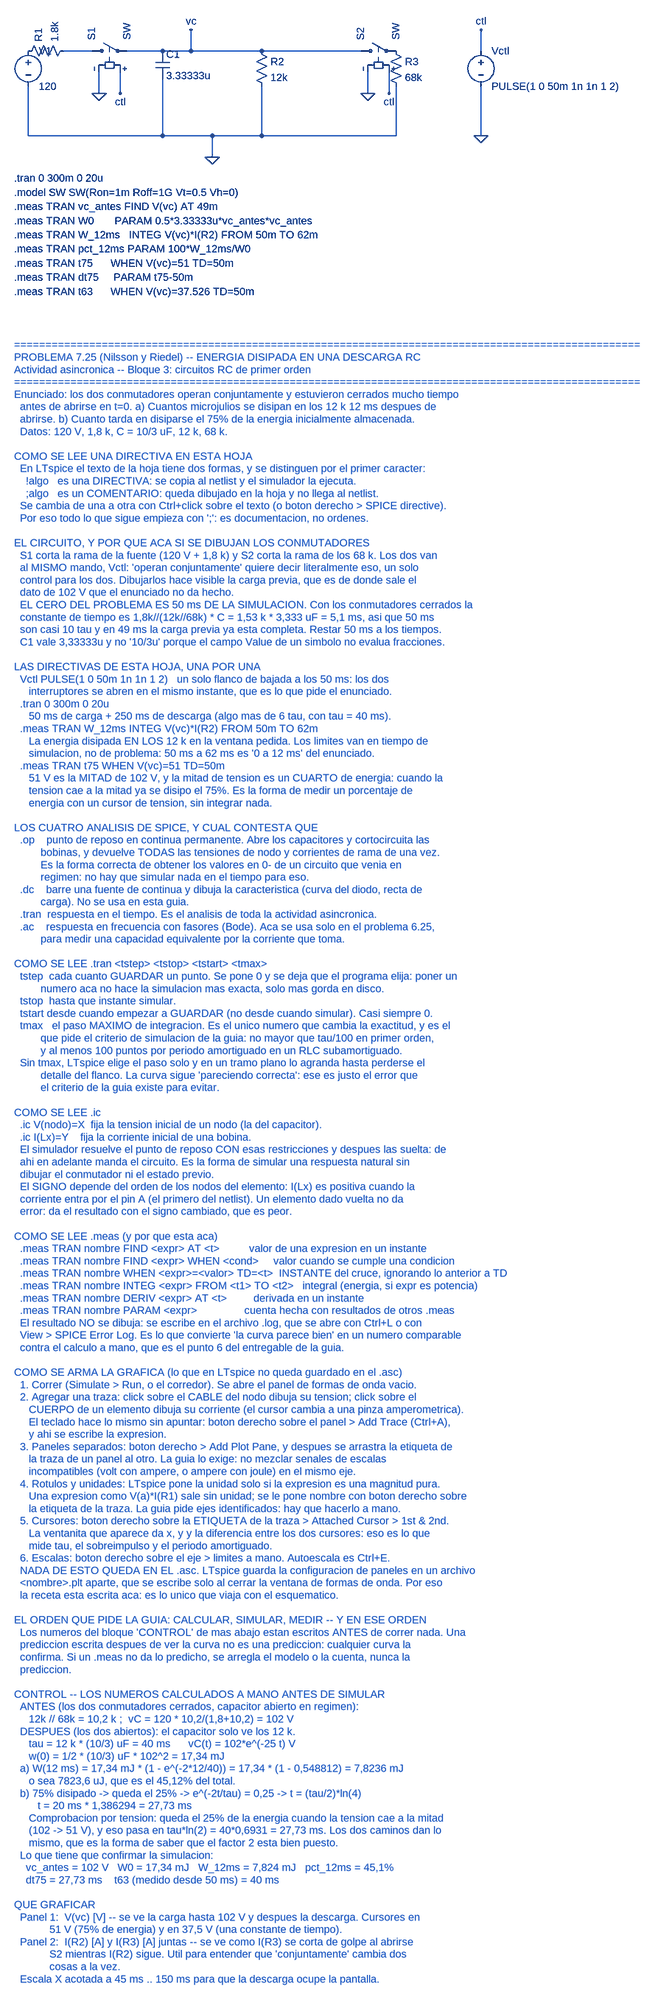
[diagram p0: schematic P7-25_RC_energia_disipada.asc]
P7-25_RC_energia_disipada.asc, the LTspice schematic file:
Version 4
SHEET 1 2200 2800
WIRE 96 192 96 304
WIRE 176 112 240 112
WIRE 320 112 400 112
WIRE 400 176 400 304
WIRE 624 192 624 304
WIRE 400 112 624 112
WIRE 624 112 848 112
WIRE 928 192 928 304
WIRE 96 304 928 304
WIRE 512 304 512 352
WIRE 464 112 464 64
WIRE 256 160 256 208
WIRE 304 160 304 208
WIRE 864 160 864 208
WIRE 912 160 912 208
WIRE 1120 112 1120 64
WIRE 1120 192 1120 304
FLAG 512 352 0
FLAG 464 64 vc
FLAG 256 208 0
FLAG 304 208 ctl
FLAG 864 208 0
FLAG 912 208 ctl
FLAG 1120 64 ctl
FLAG 1120 304 0
SYMBOL voltage 96 96 R0
WINDOW 123 0 0 Left 0
WINDOW 39 0 0 Left 0
SYMATTR InstName V1
SYMATTR Value 120
SYMBOL res 80 128 R270
SYMATTR InstName R1
SYMATTR Value 1.8k
SYMBOL sw 224 112 R270
SYMATTR InstName S1
SYMATTR Value SW
SYMBOL cap 384 112 R0
SYMATTR InstName C1
SYMATTR Value 3.33333u
SYMBOL res 608 96 R0
SYMATTR InstName R2
SYMATTR Value 12k
SYMBOL sw 832 112 R270
SYMATTR InstName S2
SYMATTR Value SW
SYMBOL res 912 96 R0
SYMATTR InstName R3
SYMATTR Value 68k
SYMBOL voltage 1120 96 R0
WINDOW 123 0 0 Left 0
WINDOW 39 0 0 Left 0
SYMATTR InstName Vctl
SYMATTR Value PULSE(1 0 50m 1n 1n 1 2)
TEXT 64 400 Left 2 !.tran 0 300m 0 20u
TEXT 64 432 Left 2 !.model SW SW(Ron=1m Roff=1G Vt=0.5 Vh=0)
TEXT 64 464 Left 2 !.meas TRAN vc_antes FIND V(vc) AT 49m
TEXT 64 496 Left 2 !.meas TRAN W0       PARAM 0.5*3.33333u*vc_antes*vc_antes
TEXT 64 528 Left 2 !.meas TRAN W_12ms   INTEG V(vc)*I(R2) FROM 50m TO 62m
TEXT 64 560 Left 2 !.meas TRAN pct_12ms PARAM 100*W_12ms/W0
TEXT 64 592 Left 2 !.meas TRAN t75      WHEN V(vc)=51 TD=50m
TEXT 64 624 Left 2 !.meas TRAN dt75     PARAM t75-50m
TEXT 64 656 Left 2 !.meas TRAN t63      WHEN V(vc)=37.526 TD=50m
TEXT 64 900 Left 2 ;====================================================================================================
TEXT 64 928 Left 2 ;PROBLEMA 7.25 (Nilsson y Riedel) -- ENERGIA DISIPADA EN UNA DESCARGA RC
TEXT 64 956 Left 2 ;Actividad asincronica -- Bloque 3: circuitos RC de primer orden
TEXT 64 984 Left 2 ;====================================================================================================
TEXT 64 1012 Left 2 ;Enunciado: los dos conmutadores operan conjuntamente y estuvieron cerrados mucho tiempo
TEXT 64 1040 Left 2 ;  antes de abrirse en t=0. a) Cuantos microjulios se disipan en los 12 k 12 ms despues de
TEXT 64 1068 Left 2 ;  abrirse. b) Cuanto tarda en disiparse el 75% de la energia inicialmente almacenada.
TEXT 64 1096 Left 2 ;  Datos: 120 V, 1,8 k, C = 10/3 uF, 12 k, 68 k.
TEXT 64 1124 Left 2 ;
TEXT 64 1152 Left 2 ;COMO SE LEE UNA DIRECTIVA EN ESTA HOJA
TEXT 64 1180 Left 2 ;  En LTspice el texto de la hoja tiene dos formas, y se distinguen por el primer caracter:
TEXT 64 1208 Left 2 ;    !algo   es una DIRECTIVA: se copia al netlist y el simulador la ejecuta.
TEXT 64 1236 Left 2 ;    ;algo   es un COMENTARIO: queda dibujado en la hoja y no llega al netlist.
TEXT 64 1264 Left 2 ;  Se cambia de una a otra con Ctrl+click sobre el texto (o boton derecho > SPICE directive).
TEXT 64 1292 Left 2 ;  Por eso todo lo que sigue empieza con ';': es documentacion, no ordenes.
TEXT 64 1320 Left 2 ;
TEXT 64 1348 Left 2 ;EL CIRCUITO, Y POR QUE ACA SI SE DIBUJAN LOS CONMUTADORES
TEXT 64 1376 Left 2 ;  S1 corta la rama de la fuente (120 V + 1,8 k) y S2 corta la rama de los 68 k. Los dos van
TEXT 64 1404 Left 2 ;  al MISMO mando, Vctl: 'operan conjuntamente' quiere decir literalmente eso, un solo
TEXT 64 1432 Left 2 ;  control para los dos. Dibujarlos hace visible la carga previa, que es de donde sale el
TEXT 64 1460 Left 2 ;  dato de 102 V que el enunciado no da hecho.
TEXT 64 1488 Left 2 ;  EL CERO DEL PROBLEMA ES 50 ms DE LA SIMULACION. Con los conmutadores cerrados la
TEXT 64 1516 Left 2 ;  constante de tiempo es 1,8k//(12k//68k) * C = 1,53 k * 3,333 uF = 5,1 ms, asi que 50 ms
TEXT 64 1544 Left 2 ;  son casi 10 tau y en 49 ms la carga previa ya esta completa. Restar 50 ms a los tiempos.
TEXT 64 1572 Left 2 ;  C1 vale 3,33333u y no '10/3u' porque el campo Value de un simbolo no evalua fracciones.
TEXT 64 1600 Left 2 ;
TEXT 64 1628 Left 2 ;LAS DIRECTIVAS DE ESTA HOJA, UNA POR UNA
TEXT 64 1656 Left 2 ;  Vctl PULSE(1 0 50m 1n 1n 1 2)   un solo flanco de bajada a los 50 ms: los dos
TEXT 64 1684 Left 2 ;     interruptores se abren en el mismo instante, que es lo que pide el enunciado.
TEXT 64 1712 Left 2 ;  .tran 0 300m 0 20u
TEXT 64 1740 Left 2 ;     50 ms de carga + 250 ms de descarga (algo mas de 6 tau, con tau = 40 ms).
TEXT 64 1768 Left 2 ;  .meas TRAN W_12ms INTEG V(vc)*I(R2) FROM 50m TO 62m
TEXT 64 1796 Left 2 ;     La energia disipada EN LOS 12 k en la ventana pedida. Los limites van en tiempo de
TEXT 64 1824 Left 2 ;     simulacion, no de problema: 50 ms a 62 ms es '0 a 12 ms' del enunciado.
TEXT 64 1852 Left 2 ;  .meas TRAN t75 WHEN V(vc)=51 TD=50m
TEXT 64 1880 Left 2 ;     51 V es la MITAD de 102 V, y la mitad de tension es un CUARTO de energia: cuando la
TEXT 64 1908 Left 2 ;     tension cae a la mitad ya se disipo el 75%. Es la forma de medir un porcentaje de
TEXT 64 1936 Left 2 ;     energia con un cursor de tension, sin integrar nada.
TEXT 64 1964 Left 2 ;
TEXT 64 1992 Left 2 ;LOS CUATRO ANALISIS DE SPICE, Y CUAL CONTESTA QUE
TEXT 64 2020 Left 2 ;  .op    punto de reposo en continua permanente. Abre los capacitores y cortocircuita las
TEXT 64 2048 Left 2 ;         bobinas, y devuelve TODAS las tensiones de nodo y corrientes de rama de una vez.
TEXT 64 2076 Left 2 ;         Es la forma correcta de obtener los valores en 0- de un circuito que venia en
TEXT 64 2104 Left 2 ;         regimen: no hay que simular nada en el tiempo para eso.
TEXT 64 2132 Left 2 ;  .dc    barre una fuente de continua y dibuja la caracteristica (curva del diodo, recta de
TEXT 64 2160 Left 2 ;         carga). No se usa en esta guia.
TEXT 64 2188 Left 2 ;  .tran  respuesta en el tiempo. Es el analisis de toda la actividad asincronica.
TEXT 64 2216 Left 2 ;  .ac    respuesta en frecuencia con fasores (Bode). Aca se usa solo en el problema 6.25,
TEXT 64 2244 Left 2 ;         para medir una capacidad equivalente por la corriente que toma.
TEXT 64 2272 Left 2 ;
TEXT 64 2300 Left 2 ;COMO SE LEE .tran <tstep> <tstop> <tstart> <tmax>
TEXT 64 2328 Left 2 ;  tstep  cada cuanto GUARDAR un punto. Se pone 0 y se deja que el programa elija: poner un
TEXT 64 2356 Left 2 ;         numero aca no hace la simulacion mas exacta, solo mas gorda en disco.
TEXT 64 2384 Left 2 ;  tstop  hasta que instante simular.
TEXT 64 2412 Left 2 ;  tstart desde cuando empezar a GUARDAR (no desde cuando simular). Casi siempre 0.
TEXT 64 2440 Left 2 ;  tmax   el paso MAXIMO de integracion. Es el unico numero que cambia la exactitud, y es el
TEXT 64 2468 Left 2 ;         que pide el criterio de simulacion de la guia: no mayor que tau/100 en primer orden,
TEXT 64 2496 Left 2 ;         y al menos 100 puntos por periodo amortiguado en un RLC subamortiguado.
TEXT 64 2524 Left 2 ;  Sin tmax, LTspice elige el paso solo y en un tramo plano lo agranda hasta perderse el
TEXT 64 2552 Left 2 ;         detalle del flanco. La curva sigue 'pareciendo correcta': ese es justo el error que
TEXT 64 2580 Left 2 ;         el criterio de la guia existe para evitar.
TEXT 64 2608 Left 2 ;
TEXT 64 2636 Left 2 ;COMO SE LEE .ic
TEXT 64 2664 Left 2 ;  .ic V(nodo)=X  fija la tension inicial de un nodo (la del capacitor).
TEXT 64 2692 Left 2 ;  .ic I(Lx)=Y    fija la corriente inicial de una bobina.
TEXT 64 2720 Left 2 ;  El simulador resuelve el punto de reposo CON esas restricciones y despues las suelta: de
TEXT 64 2748 Left 2 ;  ahi en adelante manda el circuito. Es la forma de simular una respuesta natural sin
TEXT 64 2776 Left 2 ;  dibujar el conmutador ni el estado previo.
TEXT 64 2804 Left 2 ;  El SIGNO depende del orden de los nodos del elemento: I(Lx) es positiva cuando la
TEXT 64 2832 Left 2 ;  corriente entra por el pin A (el primero del netlist). Un elemento dado vuelta no da
TEXT 64 2860 Left 2 ;  error: da el resultado con el signo cambiado, que es peor.
TEXT 64 2888 Left 2 ;
TEXT 64 2916 Left 2 ;COMO SE LEE .meas (y por que esta aca)
TEXT 64 2944 Left 2 ;  .meas TRAN nombre FIND <expr> AT <t>          valor de una expresion en un instante
TEXT 64 2972 Left 2 ;  .meas TRAN nombre FIND <expr> WHEN <cond>     valor cuando se cumple una condicion
TEXT 64 3000 Left 2 ;  .meas TRAN nombre WHEN <expr>=<valor> TD=<t>  INSTANTE del cruce, ignorando lo anterior a TD
TEXT 64 3028 Left 2 ;  .meas TRAN nombre INTEG <expr> FROM <t1> TO <t2>   integral (energia, si expr es potencia)
TEXT 64 3056 Left 2 ;  .meas TRAN nombre DERIV <expr> AT <t>         derivada en un instante
TEXT 64 3084 Left 2 ;  .meas TRAN nombre PARAM <expr>                cuenta hecha con resultados de otros .meas
TEXT 64 3112 Left 2 ;  El resultado NO se dibuja: se escribe en el archivo .log, que se abre con Ctrl+L o con
TEXT 64 3140 Left 2 ;  View > SPICE Error Log. Es lo que convierte 'la curva parece bien' en un numero comparable
TEXT 64 3168 Left 2 ;  contra el calculo a mano, que es el punto 6 del entregable de la guia.
TEXT 64 3196 Left 2 ;
TEXT 64 3224 Left 2 ;COMO SE ARMA LA GRAFICA (lo que en LTspice no queda guardado en el .asc)
TEXT 64 3252 Left 2 ;  1. Correr (Simulate > Run, o el corredor). Se abre el panel de formas de onda vacio.
TEXT 64 3280 Left 2 ;  2. Agregar una traza: click sobre el CABLE del nodo dibuja su tension; click sobre el
TEXT 64 3308 Left 2 ;     CUERPO de un elemento dibuja su corriente (el cursor cambia a una pinza amperometrica).
TEXT 64 3336 Left 2 ;     El teclado hace lo mismo sin apuntar: boton derecho sobre el panel > Add Trace (Ctrl+A),
TEXT 64 3364 Left 2 ;     y ahi se escribe la expresion.
TEXT 64 3392 Left 2 ;  3. Paneles separados: boton derecho > Add Plot Pane, y despues se arrastra la etiqueta de
TEXT 64 3420 Left 2 ;     la traza de un panel al otro. La guia lo exige: no mezclar senales de escalas
TEXT 64 3448 Left 2 ;     incompatibles (volt con ampere, o ampere con joule) en el mismo eje.
TEXT 64 3476 Left 2 ;  4. Rotulos y unidades: LTspice pone la unidad solo si la expresion es una magnitud pura.
TEXT 64 3504 Left 2 ;     Una expresion como V(a)*I(R1) sale sin unidad; se le pone nombre con boton derecho sobre
TEXT 64 3532 Left 2 ;     la etiqueta de la traza. La guia pide ejes identificados: hay que hacerlo a mano.
TEXT 64 3560 Left 2 ;  5. Cursores: boton derecho sobre la ETIQUETA de la traza > Attached Cursor > 1st & 2nd.
TEXT 64 3588 Left 2 ;     La ventanita que aparece da x, y y la diferencia entre los dos cursores: eso es lo que
TEXT 64 3616 Left 2 ;     mide tau, el sobreimpulso y el periodo amortiguado.
TEXT 64 3644 Left 2 ;  6. Escalas: boton derecho sobre el eje > limites a mano. Autoescala es Ctrl+E.
TEXT 64 3672 Left 2 ;  NADA DE ESTO QUEDA EN EL .asc. LTspice guarda la configuracion de paneles en un archivo
TEXT 64 3700 Left 2 ;  <nombre>.plt aparte, que se escribe solo al cerrar la ventana de formas de onda. Por eso
TEXT 64 3728 Left 2 ;  la receta esta escrita aca: es lo unico que viaja con el esquematico.
TEXT 64 3756 Left 2 ;
TEXT 64 3784 Left 2 ;EL ORDEN QUE PIDE LA GUIA: CALCULAR, SIMULAR, MEDIR -- Y EN ESE ORDEN
TEXT 64 3812 Left 2 ;  Los numeros del bloque 'CONTROL' de mas abajo estan escritos ANTES de correr nada. Una
TEXT 64 3840 Left 2 ;  prediccion escrita despues de ver la curva no es una prediccion: cualquier curva la
TEXT 64 3868 Left 2 ;  confirma. Si un .meas no da lo predicho, se arregla el modelo o la cuenta, nunca la
TEXT 64 3896 Left 2 ;  prediccion.
TEXT 64 3924 Left 2 ;
TEXT 64 3952 Left 2 ;CONTROL -- LOS NUMEROS CALCULADOS A MANO ANTES DE SIMULAR
TEXT 64 3980 Left 2 ;  ANTES (los dos conmutadores cerrados, capacitor abierto en regimen):
TEXT 64 4008 Left 2 ;     12k // 68k = 10,2 k ;  vC = 120 * 10,2/(1,8+10,2) = 102 V
TEXT 64 4036 Left 2 ;  DESPUES (los dos abiertos): el capacitor solo ve los 12 k.
TEXT 64 4064 Left 2 ;     tau = 12 k * (10/3) uF = 40 ms      vC(t) = 102*e^(-25 t) V
TEXT 64 4092 Left 2 ;     w(0) = 1/2 * (10/3) uF * 102^2 = 17,34 mJ
TEXT 64 4120 Left 2 ;  a) W(12 ms) = 17,34 mJ * (1 - e^(-2*12/40)) = 17,34 * (1 - 0,548812) = 7,8236 mJ
TEXT 64 4148 Left 2 ;     o sea 7823,6 uJ, que es el 45,12% del total.
TEXT 64 4176 Left 2 ;  b) 75% disipado -> queda el 25% -> e^(-2t/tau) = 0,25 -> t = (tau/2)*ln(4)
TEXT 64 4204 Left 2 ;        t = 20 ms * 1,386294 = 27,73 ms
TEXT 64 4232 Left 2 ;     Comprobacion por tension: queda el 25% de la energia cuando la tension cae a la mitad
TEXT 64 4260 Left 2 ;     (102 -> 51 V), y eso pasa en tau*ln(2) = 40*0,6931 = 27,73 ms. Los dos caminos dan lo
TEXT 64 4288 Left 2 ;     mismo, que es la forma de saber que el factor 2 esta bien puesto.
TEXT 64 4316 Left 2 ;  Lo que tiene que confirmar la simulacion:
TEXT 64 4344 Left 2 ;    vc_antes = 102 V   W0 = 17,34 mJ   W_12ms = 7,824 mJ   pct_12ms = 45,1%
TEXT 64 4372 Left 2 ;    dt75 = 27,73 ms    t63 (medido desde 50 ms) = 40 ms
TEXT 64 4400 Left 2 ;
TEXT 64 4428 Left 2 ;QUE GRAFICAR
TEXT 64 4456 Left 2 ;  Panel 1:  V(vc) [V] -- se ve la carga hasta 102 V y despues la descarga. Cursores en
TEXT 64 4484 Left 2 ;            51 V (75% de energia) y en 37,5 V (una constante de tiempo).
TEXT 64 4512 Left 2 ;  Panel 2:  I(R2) [A] y I(R3) [A] juntas -- se ve como I(R3) se corta de golpe al abrirse
TEXT 64 4540 Left 2 ;            S2 mientras I(R2) sigue. Util para entender que 'conjuntamente' cambia dos
TEXT 64 4568 Left 2 ;            cosas a la vez.
TEXT 64 4596 Left 2 ;  Escala X acotada a 45 ms .. 150 ms para que la descarga ocupe la pantalla.

The netlist it stands for:
* P7-25_RC_energia_disipada.asc
V1 P001 0 120
R1 P001 N001 1.8k
S1 N001 vc ctl 0 SW
C1 vc 0 3.33333u
R2 vc 0 12k
S2 vc P002 ctl 0 SW
R3 P002 0 68k
Vctl ctl 0 PULSE(1 0 50m 1n 1n 1 2)
.tran 0 300m 0 20u
.model SW SW(Ron=1m Roff=1G Vt=0.5 Vh=0)
.meas TRAN vc_antes FIND V(vc) AT 49m
.meas TRAN W0       PARAM 0.5*3.33333u*vc_antes*vc_antes
.meas TRAN W_12ms   INTEG V(vc)*I(R2) FROM 50m TO 62m
.meas TRAN pct_12ms PARAM 100*W_12ms/W0
.meas TRAN t75      WHEN V(vc)=51 TD=50m
.meas TRAN dt75     PARAM t75-50m
.meas TRAN t63      WHEN V(vc)=37.526 TD=50m
* ====================================================================================================
* PROBLEMA 7.25 (Nilsson y Riedel) -- ENERGIA DISIPADA EN UNA DESCARGA RC
* Actividad asincronica -- Bloque 3: circuitos RC de primer orden
* ====================================================================================================
* Enunciado: los dos conmutadores operan conjuntamente y estuvieron cerrados mucho tiempo
*   antes de abrirse en t=0. a) Cuantos microjulios se disipan en los 12 k 12 ms despues de
*   abrirse. b) Cuanto tarda en disiparse el 75% de la energia inicialmente almacenada.
*   Datos: 120 V, 1,8 k, C = 10/3 uF, 12 k, 68 k.
* COMO SE LEE UNA DIRECTIVA EN ESTA HOJA
*   En LTspice el texto de la hoja tiene dos formas, y se distinguen por el primer caracter:
*     !algo   es una DIRECTIVA: se copia al netlist y el simulador la ejecuta.
*     ;algo   es un COMENTARIO: queda dibujado en la hoja y no llega al netlist.
*   Se cambia de una a otra con Ctrl+click sobre el texto (o boton derecho > SPICE directive).
*   Por eso todo lo que sigue empieza con ';': es documentacion, no ordenes.
* EL CIRCUITO, Y POR QUE ACA SI SE DIBUJAN LOS CONMUTADORES
*   S1 corta la rama de la fuente (120 V + 1,8 k) y S2 corta la rama de los 68 k. Los dos van
*   al MISMO mando, Vctl: 'operan conjuntamente' quiere decir literalmente eso, un solo
*   control para los dos. Dibujarlos hace visible la carga previa, que es de donde sale el
*   dato de 102 V que el enunciado no da hecho.
*   EL CERO DEL PROBLEMA ES 50 ms DE LA SIMULACION. Con los conmutadores cerrados la
*   constante de tiempo es 1,8k//(12k//68k) * C = 1,53 k * 3,333 uF = 5,1 ms, asi que 50 ms
*   son casi 10 tau y en 49 ms la carga previa ya esta completa. Restar 50 ms a los tiempos.
*   C1 vale 3,33333u y no '10/3u' porque el campo Value de un simbolo no evalua fracciones.
* LAS DIRECTIVAS DE ESTA HOJA, UNA POR UNA
*   Vctl PULSE(1 0 50m 1n 1n 1 2)   un solo flanco de bajada a los 50 ms: los dos
*      interruptores se abren en el mismo instante, que es lo que pide el enunciado.
*   .tran 0 300m 0 20u
*      50 ms de carga + 250 ms de descarga (algo mas de 6 tau, con tau = 40 ms).
*   .meas TRAN W_12ms INTEG V(vc)*I(R2) FROM 50m TO 62m
*      La energia disipada EN LOS 12 k en la ventana pedida. Los limites van en tiempo de
*      simulacion, no de problema: 50 ms a 62 ms es '0 a 12 ms' del enunciado.
*   .meas TRAN t75 WHEN V(vc)=51 TD=50m
*      51 V es la MITAD de 102 V, y la mitad de tension es un CUARTO de energia: cuando la
*      tension cae a la mitad ya se disipo el 75%. Es la forma de medir un porcentaje de
*      energia con un cursor de tension, sin integrar nada.
* LOS CUATRO ANALISIS DE SPICE, Y CUAL CONTESTA QUE
*   .op    punto de reposo en continua permanente. Abre los capacitores y cortocircuita las
*          bobinas, y devuelve TODAS las tensiones de nodo y corrientes de rama de una vez.
*          Es la forma correcta de obtener los valores en 0- de un circuito que venia en
*          regimen: no hay que simular nada en el tiempo para eso.
*   .dc    barre una fuente de continua y dibuja la caracteristica (curva del diodo, recta de
*          carga). No se usa en esta guia.
*   .tran  respuesta en el tiempo. Es el analisis de toda la actividad asincronica.
*   .ac    respuesta en frecuencia con fasores (Bode). Aca se usa solo en el problema 6.25,
*          para medir una capacidad equivalente por la corriente que toma.
* COMO SE LEE .tran <tstep> <tstop> <tstart> <tmax>
*   tstep  cada cuanto GUARDAR un punto. Se pone 0 y se deja que el programa elija: poner un
*          numero aca no hace la simulacion mas exacta, solo mas gorda en disco.
*   tstop  hasta que instante simular.
*   tstart desde cuando empezar a GUARDAR (no desde cuando simular). Casi siempre 0.
*   tmax   el paso MAXIMO de integracion. Es el unico numero que cambia la exactitud, y es el
*          que pide el criterio de simulacion de la guia: no mayor que tau/100 en primer orden,
*          y al menos 100 puntos por periodo amortiguado en un RLC subamortiguado.
*   Sin tmax, LTspice elige el paso solo y en un tramo plano lo agranda hasta perderse el
*          detalle del flanco. La curva sigue 'pareciendo correcta': ese es justo el error que
*          el criterio de la guia existe para evitar.
* COMO SE LEE .ic
*   .ic V(nodo)=X  fija la tension inicial de un nodo (la del capacitor).
*   .ic I(Lx)=Y    fija la corriente inicial de una bobina.
*   El simulador resuelve el punto de reposo CON esas restricciones y despues las suelta: de
*   ahi en adelante manda el circuito. Es la forma de simular una respuesta natural sin
*   dibujar el conmutador ni el estado previo.
*   El SIGNO depende del orden de los nodos del elemento: I(Lx) es positiva cuando la
*   corriente entra por el pin A (el primero del netlist). Un elemento dado vuelta no da
*   error: da el resultado con el signo cambiado, que es peor.
* COMO SE LEE .meas (y por que esta aca)
*   .meas TRAN nombre FIND <expr> AT <t>          valor de una expresion en un instante
*   .meas TRAN nombre FIND <expr> WHEN <cond>     valor cuando se cumple una condicion
*   .meas TRAN nombre WHEN <expr>=<valor> TD=<t>  INSTANTE del cruce, ignorando lo anterior a TD
*   .meas TRAN nombre INTEG <expr> FROM <t1> TO <t2>   integral (energia, si expr es potencia)
*   .meas TRAN nombre DERIV <expr> AT <t>         derivada en un instante
*   .meas TRAN nombre PARAM <expr>                cuenta hecha con resultados de otros .meas
*   El resultado NO se dibuja: se escribe en el archivo .log, que se abre con Ctrl+L o con
*   View > SPICE Error Log. Es lo que convierte 'la curva parece bien' en un numero comparable
*   contra el calculo a mano, que es el punto 6 del entregable de la guia.
* COMO SE ARMA LA GRAFICA (lo que en LTspice no queda guardado en el .asc)
*   1. Correr (Simulate > Run, o el corredor). Se abre el panel de formas de onda vacio.
*   2. Agregar una traza: click sobre el CABLE del nodo dibuja su tension; click sobre el
*      CUERPO de un elemento dibuja su corriente (el cursor cambia a una pinza amperometrica).
*      El teclado hace lo mismo sin apuntar: boton derecho sobre el panel > Add Trace (Ctrl+A),
*      y ahi se escribe la expresion.
*   3. Paneles separados: boton derecho > Add Plot Pane, y despues se arrastra la etiqueta de
*      la traza de un panel al otro. La guia lo exige: no mezclar senales de escalas
*      incompatibles (volt con ampere, o ampere con joule) en el mismo eje.
*   4. Rotulos y unidades: LTspice pone la unidad solo si la expresion es una magnitud pura.
*      Una expresion como V(a)*I(R1) sale sin unidad; se le pone nombre con boton derecho sobre
*      la etiqueta de la traza. La guia pide ejes identificados: hay que hacerlo a mano.
*   5. Cursores: boton derecho sobre la ETIQUETA de la traza > Attached Cursor > 1st & 2nd.
*      La ventanita que aparece da x, y y la diferencia entre los dos cursores: eso es lo que
*      mide tau, el sobreimpulso y el periodo amortiguado.
*   6. Escalas: boton derecho sobre el eje > limites a mano. Autoescala es Ctrl+E.
*   NADA DE ESTO QUEDA EN EL .asc. LTspice guarda la configuracion de paneles en un archivo
*   <nombre>.plt aparte, que se escribe solo al cerrar la ventana de formas de onda. Por eso
*   la receta esta escrita aca: es lo unico que viaja con el esquematico.
* EL ORDEN QUE PIDE LA GUIA: CALCULAR, SIMULAR, MEDIR -- Y EN ESE ORDEN
*   Los numeros del bloque 'CONTROL' de mas abajo estan escritos ANTES de correr nada. Una
*   prediccion escrita despues de ver la curva no es una prediccion: cualquier curva la
*   confirma. Si un .meas no da lo predicho, se arregla el modelo o la cuenta, nunca la
*   prediccion.
* CONTROL -- LOS NUMEROS CALCULADOS A MANO ANTES DE SIMULAR
*   ANTES (los dos conmutadores cerrados, capacitor abierto en regimen):
*      12k // 68k = 10,2 k ;  vC = 120 * 10,2/(1,8+10,2) = 102 V
*   DESPUES (los dos abiertos): el capacitor solo ve los 12 k.
*      tau = 12 k * (10/3) uF = 40 ms      vC(t) = 102*e^(-25 t) V
*      w(0) = 1/2 * (10/3) uF * 102^2 = 17,34 mJ
*   a) W(12 ms) = 17,34 mJ * (1 - e^(-2*12/40)) = 17,34 * (1 - 0,548812) = 7,8236 mJ
*      o sea 7823,6 uJ, que es el 45,12% del total.
*   b) 75% disipado -> queda el 25% -> e^(-2t/tau) = 0,25 -> t = (tau/2)*ln(4)
*         t = 20 ms * 1,386294 = 27,73 ms
*      Comprobacion por tension: queda el 25% de la energia cuando la tension cae a la mitad
*      (102 -> 51 V), y eso pasa en tau*ln(2) = 40*0,6931 = 27,73 ms. Los dos caminos dan lo
*      mismo, que es la forma de saber que el factor 2 esta bien puesto.
*   Lo que tiene que confirmar la simulacion:
*     vc_antes = 102 V   W0 = 17,34 mJ   W_12ms = 7,824 mJ   pct_12ms = 45,1%
*     dt75 = 27,73 ms    t63 (medido desde 50 ms) = 40 ms
* QUE GRAFICAR
*   Panel 1:  V(vc) [V] -- se ve la carga hasta 102 V y despues la descarga. Cursores en
*             51 V (75% de energia) y en 37,5 V (una constante de tiempo).
*   Panel 2:  I(R2) [A] y I(R3) [A] juntas -- se ve como I(R3) se corta de golpe al abrirse
*             S2 mientras I(R2) sigue. Util para entender que 'conjuntamente' cambia dos
*             cosas a la vez.
*   Escala X acotada a 45 ms .. 150 ms para que la descarga ocupe la pantalla.
.backanno
.end